# Altium project monitorHolter.PrjPcb (part 1 of 2)
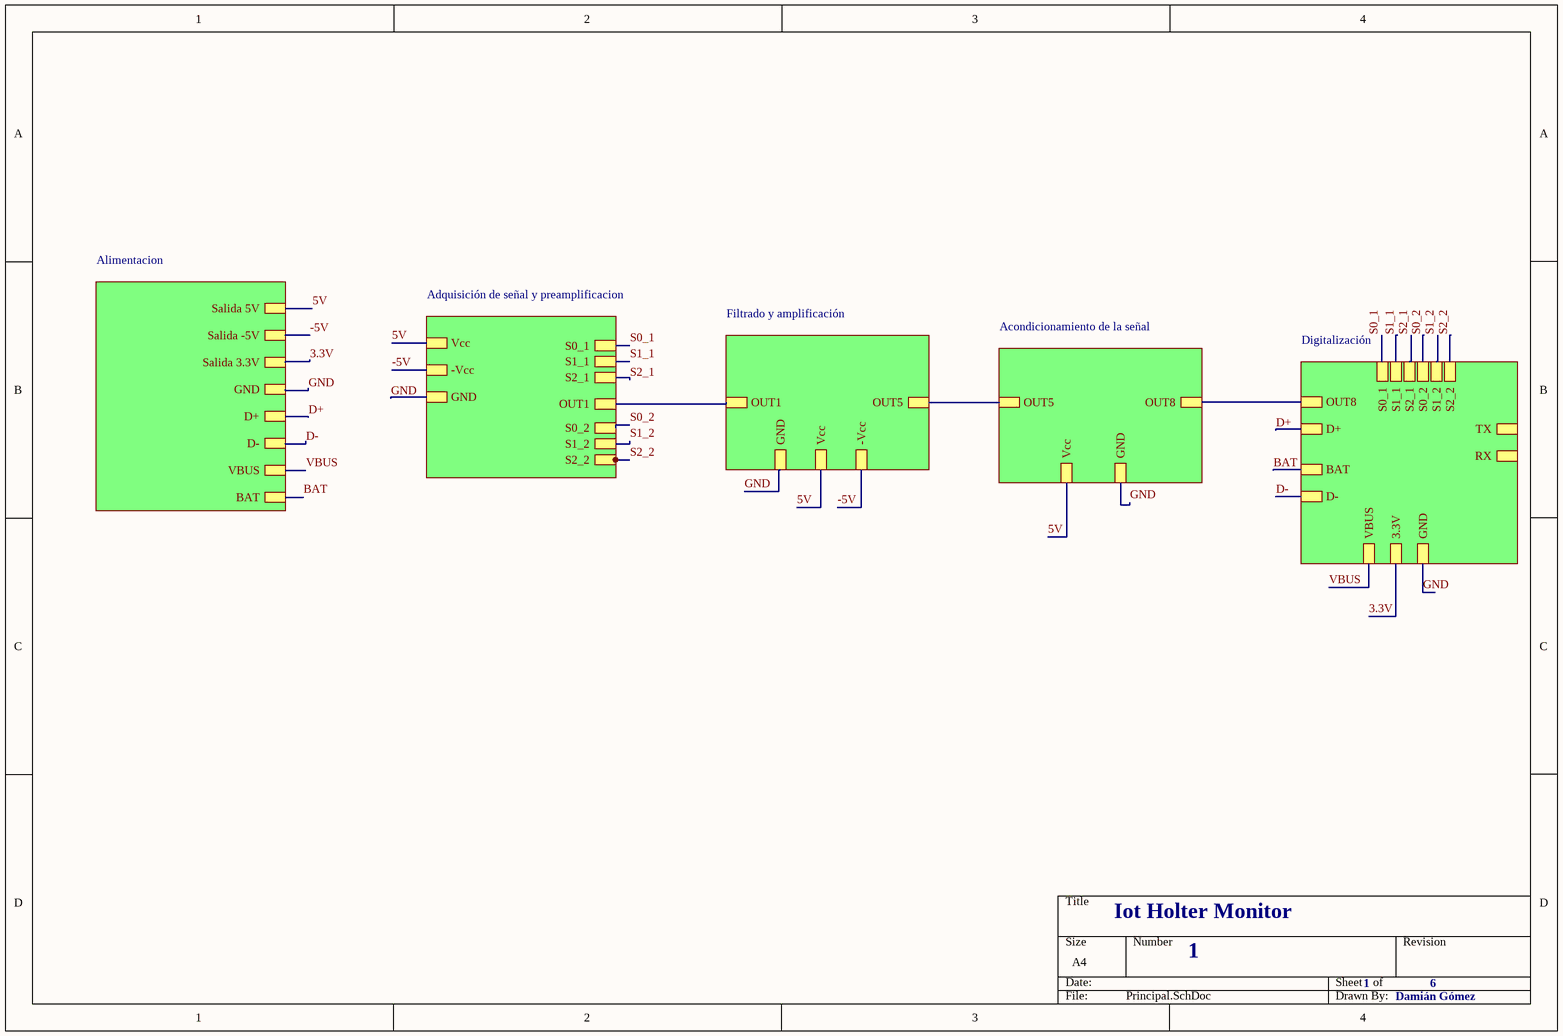
[diagram p0: Principal.SchDoc]
6 sheets, 147 parts. Net scope: hierarchical (ports join the sheet entries above them; power ports are global).
Board files: PCB1.PcbDoc, PCB_MonitorHolter.PcbDoc
Sheets:
  Principal.SchDoc
    Alimentacion = Alimentacion.SchDoc
    Adquisición de señal y preamplificacion = Adquisicion de señal y preamplificacion.SchDoc
    Filtrado y amplificación = Filtrado y amplificación.SchDoc
    Acondicionamiento de la señal = Acondicionamiento de la señal.SchDoc
    Digitalización = Digitalización.SchDoc

## Sheet Principal.SchDoc
size A4; SheetNumber: 1

### Sub-sheets
Acondicionamiento de la señal = Acondicionamiento de la señal: OUT8, OUT5, Vcc, GND
Adquisición de señal y preamplificacion = Adquisicion de señal y preamplificacion: -Vcc, Vcc, GND, S2_1, S1_2, S1_1, S0_2, S0_1, S2_2, OUT1
Alimentacion = Alimentacion: Salida 3.3V, Salida -5V, Salida 5V, GND, D-, D+, VBUS, BAT
Digitalización = Digitalización: VBUS, TX, RX, GND, D-, D+, BAT, 3.3V, OUT8, S0_1, S1_1, S1_2, S0_2, S2_1, S2_2
Filtrado y amplificación = Filtrado y amplificación: OUT5, OUT1, GND, Vcc, -Vcc

### Nets
GND: sheet Alimentacion/GND, sheet Adquisición de señal y preamplificacion/GND, sheet Filtrado y amplificación/GND, sheet Acondicionamiento de la señal/GND, sheet Digitalización/GND
VBUS: sheet Alimentacion/VBUS, sheet Digitalización/VBUS
3.3V: sheet Alimentacion/Salida 3.3V, sheet Digitalización/3.3V
5V: sheet Alimentacion/Salida 5V, sheet Adquisición de señal y preamplificacion/Vcc, sheet Filtrado y amplificación/Vcc, sheet Acondicionamiento de la señal/Vcc
-5V: sheet Alimentacion/Salida -5V, sheet Adquisición de señal y preamplificacion/-Vcc, sheet Filtrado y amplificación/-Vcc
BAT: sheet Alimentacion/BAT, sheet Digitalización/BAT
D+: sheet Alimentacion/D+, sheet Digitalización/D+
D-: sheet Alimentacion/D-, sheet Digitalización/D-
OUT1: sheet Adquisición de señal y preamplificacion/OUT1, sheet Filtrado y amplificación/OUT1
OUT5: sheet Filtrado y amplificación/OUT5, sheet Acondicionamiento de la señal/OUT5
OUT8: sheet Acondicionamiento de la señal/OUT8, sheet Digitalización/OUT8
S0_1: sheet Adquisición de señal y preamplificacion/S0_1, sheet Digitalización/S0_1
S0_2: sheet Adquisición de señal y preamplificacion/S0_2, sheet Digitalización/S0_2
S1_1: sheet Adquisición de señal y preamplificacion/S1_1, sheet Digitalización/S1_1
S1_2: sheet Adquisición de señal y preamplificacion/S1_2, sheet Digitalización/S1_2
S2_1: sheet Adquisición de señal y preamplificacion/S2_1, sheet Digitalización/S2_1
S2_2: sheet Adquisición de señal y preamplificacion/S2_2, sheet Digitalización/S2_2

### Notes on the sheet
- Iot Holter Monitor
- 1
- 6
- Damián Gómez

## Sheet Alimentacion.SchDoc
size A4; SheetNumber: 2
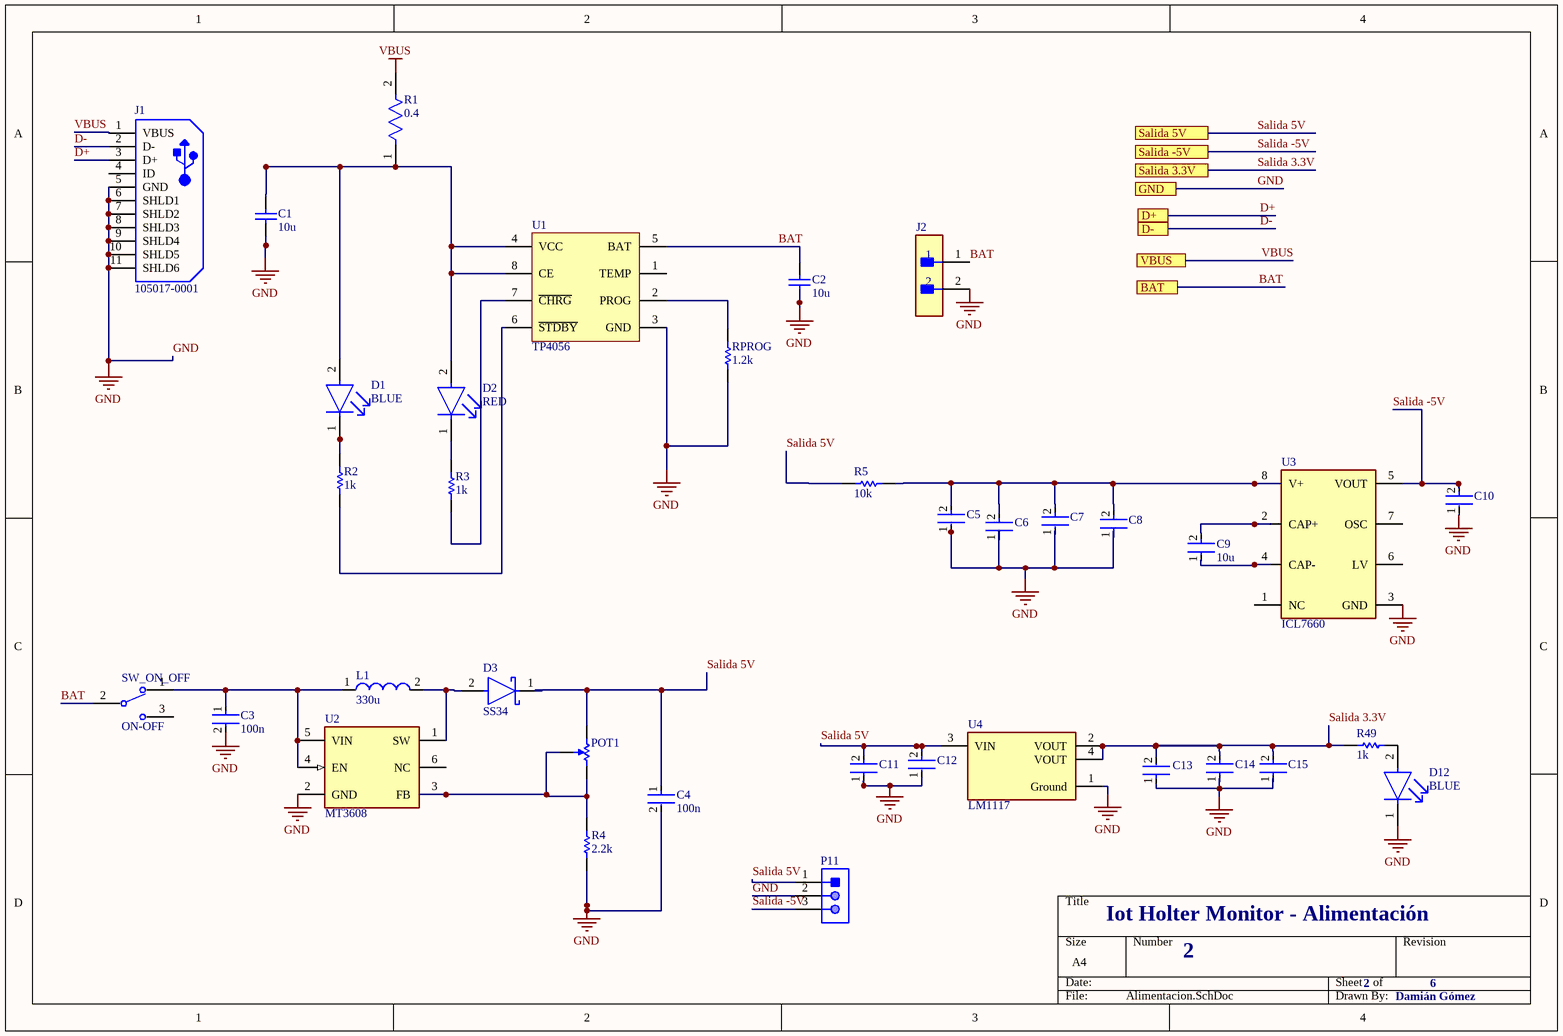
[diagram p1: Alimentacion.SchDoc]

### Parts
C1  10u  [KEMT-1206-2_M]
C2  10u  [CAPC3216X190X55LL30T25]
C3  100n  [FP-CL31-IPC_C]
C4  100n  [FP-CL31-IPC_C]
C5  GRM2165C1H332JA01D  [FP-GRM216-0_1-IPC_B]  (value not drawn)
C6  GRM2165C1H332JA01D  [FP-GRM216-0_1-IPC_B]  (value not drawn)
C7  GRM2165C1H332JA01D  [FP-GRM216-0_1-IPC_B]  (value not drawn)
C8  GRM2165C1H332JA01D  [FP-GRM216-0_1-IPC_B]  (value not drawn)
C9  10u  [FP-GRM216-0_1-IPC_B]
C10  GRM2165C1H332JA01D  [FP-GRM216-0_1-IPC_B]  (value not drawn)
C11  GRM2165C1H332JA01D  [FP-GRM216-0_1-IPC_B]  (value not drawn)
C12  GRM2165C1H332JA01D  [FP-GRM216-0_1-IPC_B]  (value not drawn)
C13  10uF  [FP-CL31-IPC_C]  (value not drawn)
C14  GRM2165C1H332JA01D  [FP-GRM216-0_1-IPC_C]  (value not drawn)
C15  GRM2165C1H332JA01D  [FP-GRM216-0_1-IPC_C]  (value not drawn)
D1  BLUE  [FP-LTST-C191TBKT-MFG]
D2  RED  [FP-LTST-C191TBKT-MFG]
D3  SS34  [FP-95402-MFG]
D12  BLUE  [FP-LTST-C191TBKT-MFG]
J1  105017-0001  [USB-MICRO-B_V]
J2  TSW-102-07-L-S  [FP-TSW-102-07-L-S-MFG]  (value not drawn)
L1  330u  [WE-PD 1050]
P11  640456-3  [TECO-640456-3]  (value not drawn)
POT1  3386P-1-104LF  [BOUR-3386P]  (value not drawn)
R1  0.4  [FP-RC3216-MFG]
R2  1k  [RESC2013X50X30LL20T20]
R3  1k  [RESC2013X50X30LL20T20]
R4  2.2k  [RESC2013X50X30LL20T20]
R5  10k  [RESC2013X50X30LL20T20]
R49  1k  [RESC2013X50X30LL20T20]
RPROG  1.2k  [RESC2013X50X30LL20T20]
SW_ON_OFF  ON-OFF  [FP-1825115-1-MFG]
U1  TP4056  [LT-S8-8_N]
U2  MT3608  [FP-SOT26_SC74R-MFG]
U3  ICL7660  [FP-S8-4-MFG]
U4  LM1117  [FP-AMS1117-IPC_C]

### Ports
BAT, D+, D-, GND, Salida 3.3V, Salida 5V, Salida -5V, VBUS

### Nets
GND: C1.1 C2.1 C3.2 C4.2 C5.1 C6.1 C7.1 C8.1 C10.1 C11.1 C12.1 C13.1 C14.1 C15.1 D12.1(C) J1.5(GND) J1.6(SHLD1) J1.7(SHLD2) J1.8(SHLD3) J1.9(SHLD4) J1.10(SHLD5) J1.11(SHLD6) J2.2 P11.2 R4.1 RPROG.1 U1.3(GND) U2.2(GND) U3.3(GND) U4.1(Ground) ; port GND
VBUS: J1.1(VBUS) R1.2 ; port VBUS
BAT: C2.2 J2.1 SW_ON_OFF.2 U1.5(BAT) ; port BAT
D+: J1.3(D+) ; port D+
D-: J1.2(D-) ; port D-
Salida 3.3V: C13.2 C14.2 C15.2 R49.1 U4.2(VOUT) U4.4(VOUT) ; port Salida 3.3V  [project net 3.3V]
Salida 5V: C4.1 C11.2 C12.2 D3.1(C) P11.1 POT1.1 R5.1 U4.3(VIN) ; port Salida 5V  [project net 5V]
Salida -5V: C10.2 P11.3 U3.5(VOUT) ; port Salida -5V  [project net -5V]
NetC1_2: C1.2 D1.2(A) D2.2(A) R1.1 U1.4(VCC) U1.8(CE)
NetC3_1: C3.1 L1.1 SW_ON_OFF.1 U2.4(EN) U2.5(VIN)
NetC5_2: C5.2 C6.2 C7.2 C8.2 R5.2 U3.8(V+)
NetC9_1: C9.1 U3.4(CAP-)
NetC9_2: C9.2 U3.2(CAP+)
NetD1_1: D1.1(C) R2.2
NetD2_1: D2.1(C) R3.2
NetD3_2: D3.2(A) L1.2 U2.1(SW)
NetD12_2: D12.2(A) R49.2
NetPOT1_2: POT1.2 POT1.3 R4.2 U2.3(FB)
NetR2_1: R2.1 U1.6(~{STDBY})
NetR3_1: R3.1 U1.7(~{CHRG})
NetRPROG_2: RPROG.2 U1.2(PROG)

Not connected (* = marked no-connect by the designer): J1 4(ID); SW_ON_OFF 3; U1 1(TEMP); U2 6(NC); U3 1(NC) 6(LV) 7(OSC)

### Notes on the sheet
- Iot Holter Monitor - Alimentación
- 2
- 6
- Damián Gómez

### Library data of the parts
C1 = CMP-1037-04202-2: CAP, Ceramic, 0.1 uF, +/- 10%, 50 V, -55 to 125 degC, 1206 (3216 Metric), RoHS, Tape and Reel; Manufacturer: Kemet; Voltage Rating: 50V; Capacitance: 0.1µF; Product Range: KEMET-CSeries; SVHC: ToBeAdvised; Dielectric Characteristic: X7R; Capacitor Case Style: 1206[3216Metric]; Package Reference: 1206-2; Package Description: 2-Leads SMD, Body 3.2 x 1.6 mm; Packaging: Tape&Reel; Operating Temperature Max: 125degC; Capacitance Tolerance: ±10%; Datasheet URL: https://datasheet.ciiva.com/6125/1725438-6125494.pdf; Manufacturer URL: http://www.kemet.com/; Operating Temperature Min: -55degC; Datasheet Version: Jul-13
C2 = CMP-1662-00011-2: Chip Capacitor, 10 uF, +/- 20%, 6.3 V, -55 to 85 degC, 1206 (3216 Metric), RoHS, Tape and Reel; PartNumber: GRM31CR60J107ME39L; Case\/Package: 1206; Capacitance: 100 uF; Voltage Rating (DC): 6.3 V; Type (Capacitors): X5R; REACH SVHC: No SVHC; Height: 1.6 mm; Tolerance: 20%; Packaging: Tape and Reel; Mount: Surface Mount; PackageDescription: 2-Pin Surface Mount Device, Body 3.2 x 1.6 mm; ComponentLink1URL: http://www.murata.com/; Pins: 2; ComponentLink2Description: Datasheet; PackageReference: 1206; Width: 1.6 mm; Package Quantity: 2000; Min Operating Temperature: -55 degC; Case Code (Imperial): 1206; Max Operating Temperature: 85 degC; DatasheetVersion: 09/2016; Mounting Technology: Surface Mount; Voltage Rating: 6.3 V; ComponentLink1Description: Manufacturer URL; Radiation Hardening: No; Case Code (Metric): 3216; Length: 3.2 mm; ComponentLink2URL: http://psearch.en.murata.com/capacitor/product/GRM31CR60J107ME39%23.pdf; RoHSCompliant: true
C3 C4 = CMP-13271-001211-1: Cap Ceramic 100nF 500V C0G ±5% SMD 1206 +125°C Embossed T/R; Capacitance: 220pF; Tolerance: 5%; Voltage Rating (DC): 500V; Depth: 1.6mm; Max Operating Temperature: 125°C; Width: 0.063inch; Radiation Hardening: No; Thickness: 0.055inch; Packaging: Tape and Reel; Height: 1.25mm; Case/Package: 1206; Package Quantity: 10000; Dielectric: C0G; Mount: Surface Mount; Voltage Rating: 500V; Min Operating Temperature: -55°C; Length: 3.2mm
C5-C12 C14 C15 = CMP-2007-00889-2: Chip Multilayer Ceramic Capacitors for General Purpose, 0805, 3300pF, C0G, 30ppm/°C, 5%, 50V; Insulation Resistance: 10GR; Capacitance: 3.3nF; Mount: Surface Mount; Case/Package: 0805; Case Code (Imperial): 0805; Lead Free: Lead Free; RoHS Compliant: Yes; Dielectric: C0G; Material: Ceramic; Size: 0.6mm; Voltage Rating (DC): 50V; Voltage: 50V; Termination: SMD/SMT; Case Code (Metric): 2012; Construction: Flat; Max Operating Temperature: 125°C; Series: GRM; Min Operating Temperature: -55°C; Temperature Coefficient: 30ppm/°C; Packaging: Tape and Reel; Height: 0.6mm; REACH SVHC: No SVHC; Width: 0.049inch; Length: 2mm; Thickness: 0.028inch; Voltage Rating: 50V; Tolerance: 5%; Number of Pins: 2; Package Quantity: 1; Dielectric Material: Ceramic; Depth: 1.25mm
C13 = CMP-13271-001211-1: Cap Ceramic 10uF 500V C0G ±5% SMD 1206 +125°C Embossed T/R; Capacitance: 220pF; Tolerance: 5%; Voltage Rating (DC): 500V; Depth: 1.6mm; Max Operating Temperature: 125°C; Width: 0.063inch; Radiation Hardening: No; Thickness: 0.055inch; Packaging: Tape and Reel; Height: 1.25mm; Case/Package: 1206; Package Quantity: 10000; Dielectric: C0G; Mount: Surface Mount; Voltage Rating: 500V; Min Operating Temperature: -55°C; Length: 3.2mm
D1 D2 D12 = CMP-22017-000008-1: LED BLUE CLEAR CHIP SMD; Lens Color: Colorless; Dominant Wavelength: 475nm; Forward Current: 20mA; Wavelength: 468nm; Viewing Angle: 130°; Power Dissipation: 76mW; Luminous Intensity: 180mcd; Reverse Voltage: 5V; Number of Elements: 1; Lens Style: Diffused; Forward Voltage: 3.8V; Max Power Dissipation: 75mW; Case Code (Metric): 1608; Packaging: Tape and Reel; Case/Package: 0603; Depth: 1.6mm; Mount: Surface Mount; Lead Free: Lead Free; Min Operating Temperature: -20°C; Lens Transparency: Clear; Illumination Color: Blue; Height: 0.55mm; Test Current: 20mA; Case Code (Imperial): 0603; Max Operating Temperature: 80°C; Number of Pins: 2; Length: 0.8mm; Radiation Hardening: No; Package Quantity: 1; Number of LEDs: 1; Width: 0.8mm; Color: Blue
D3 = CMP-02539-000012-1: DIODE SCHOTTKY 40V 3A DO214AB; Manufacturer: Vishay; Manufacturer Part Number: SS34-E3/57T; Max Junction Temp: +150°C; Peak Reverse Current: 0.5mA; Max Surge Forward Current: 100A; Standoff Height: 0mm; ComponentLink2Description: Datasheet; Device Class L3: Schottky Diodes; Height: 2.62mm; Max Repetitive Reverse Voltage: 40V; Lead Free: Yes; Package: 95402; Temperature Range High: +150°C; ComponentLink2URL: http://www.vishay.com/docs/88751/ss32.pdf; Temperature: -55°C to +150°C; Footprint Url: http://www.vishay.com/docs/95402/smc.pdf; Automotive: No; Forward Current: 3A; Category: Diode; RoHS: TRUE; Device Class L2: Diodes; Mouser Description: Schottky Diodes & Rectifiers 3.0 Amp 40 Volt; Octopart: https://octopart.com/ss34-e3%2F57t-vishay-39552907; Temperature Range Low: -55°C; Device Class L1: Discrete Semiconductors; Digikey Description: DIODE SCHOTTKY 40V 3A DO214AB
J1 = CMP-2000-05827-1: Micro-USB B Receptacle, Right Angle, Bottom Mount, Surface Mount, with Solder Tabs, -30 to 85 degC, 5-Pin USB, RoHS, Tape and Reel; Manufacturer: Molex; Featured Product: Micro-USBConnectorsUSBConnectors; Other Names: WM1399DKR; Package Version: Rev. F, 12/2012; Number of Contacts: 5; Connector Type: USB-microB; Catalog Drawings: 1050170001; 3D Model: 105017-0001.stp; Mating Products: WM17145-ND-CABLEMICROUSBBTOSTDA1.0MWM17147-ND-CABLEMICROUSBBTOSTDA2.0MWM17146-ND-CABLEMICROUSBBTOSTDA1.5M; PCN Assembly/Origin: ResinSupplier21/Oct/2015; Voltage - Max: 30V; Online Catalog: Molex-MicroUSB; Manufacturer URL: http://www.molex.com/; Package Description: 5-Leads USB, Micro B, Body 7.5 x 5 mm, Pitch 0.65 mm; Datasheet URL: http://www.molex.com/elqNow/elqRedir.htm?ref=http://www.molex.com/webdocs/datasheets/pdf/en-us/1050170001_IO_CONNECTORS.pdf; Ingress Protection: -; Datasheet Version: 03/2016; Mounting Type: BoardCutout,SurfaceMount,RightAngle; Circuits: 5; Standard Package: 1; Package Reference: MICRO-B; Package URL: http://www.molex.com/pdm_docs/sd/1050170001_sd.pdf; Category: Connectors,Interconnects; Series: -; RoHS Information: 1050170001CertofCompliance; Features: Shielded,SolderRetention; Family: USB,DVI,HDMIConnectors; Specifications: -; Gender: Receptacle; Packaging: Digi-Reel®; Mounting Technology: SurfaceMount
J2 = CMP-02766-001428-1: CONN HEADER VERT 2POS 2.54MM; Voltage Rating: 550V; Current Rating: 7.6A; Gender: Male; Number of Contacts: 2; Connector Type: Male Pin; Radiation Hardening: No; Orientation: Straight; Contact Plating: Gold; Max Operating Temperature: 125°C; Mount: Through Hole; Package Quantity: 1; Number of Rows: 1; Housing Material: Polyester; RoHS Compliant: Yes; Length: 5.08mm; Max Voltage Rating (AC): 550V; Pitch: 2.54mm; Packaging: Bulk; Depth: 2.54mm; Termination: Solder; Min Operating Temperature: -55°C; Housing Color: Black; Lead Free: Lead Free; Color: Black; Number of Positions: 2; Width: 2.54mm; Max Current Rating: 7.6A; REACH SVHC: No SVHC; Contact Material: Bronze; Contact Mating Length: 0.23inch; Series: TSW; Contact Type: Male Pin
L1 = CMP-1396-00019-1: SMD-Shielded Power Inductor WE-PD, L=330 µH; Manufacturer: Wuerth Elektronik; PartNumber: 7447714331; Inductance: 330 ÂµH; PackageReference: WE-PD 1050; ComponentLink1URL: http://www.we-online.com; ComponentLink1Description: Manufacturer URL; ComponentLink2Description: Datasheet; ComponentLink2URL: http://www.we-online.de/katalog/media/pdf/7447714331.pdf
P11 = CMP-2000-05418-1: Male Header, Pitch 2.54 mm, 1 x 3 Position, Height 10.03 mm, Tail Length 3.56 mm, -55 to 105 degC; Manufacturer: TE Connectivity; Agency Approvals: CSA,UL; Angle: Straight; Number of Positions: 3; Standards: RoHSCompliant,ELVCompliant,UL94V-0; Current, Rating: 5 / A; Connector Type: MTA-100; Mount Angle: Vertical; Material, Housing: Polyester; Temperature, Operating: -55to+105 / degC; Voltage, Rating: 250 / V; Color, Housing: White; Contact Centerline Spacing: 0.100 / in.; Special Features: Pinstrip; Material, Contact: CopperAlloy; Contact Termination Area Plating: Tin; Primary Type: InterconnectSystem; Pin Spacing: 0.1 / "; Brand/Series: MTA-100Series; Mounting Hole Size: 0.04 / "; Manufacturer URL: http://www.te.com/; Datasheet URL: https://datasheet.ciiva.com/16456/eng-ds-82056-mta-0608-16456886.pdf; Flammability Rating: UL94V-0; Mounting Type: PCMount; Contact Mating Area Plating: Tin; Datasheet Version: Jun-08; Number of Rows: 1; Termination: Solder; Type: PCBPlug; Length, Pin: 0.14 / "; Color: White; Contact Plating: Tin; Contact Shape: Square; Number of Contacts: 3; Size, Post: 0.025 / in.; Length, Terminal Post: 0.14 / in.; Length, Overall: 0.3 / "
POT1 = CMP-2000-05592-1: Square Trimpot(R) Trimming Potentiometer, 100 KOhm, +/- 10%, 0.5 W, -55 to 125 degC, 3-Pin THD, RoHS, Tube; Manufacturer Series: 3386; Manufacturer: Bourns; Resistive Element Material: Cermet; Shaft Diameter: 3.15mm; Number of Turns: 1; Product Height: 4.83mm; Temperature Coefficient: 100ppm/C; Product Depth: 9.53mm; Rated Temperature (Cel): 85; Actuator Orientation: Vertical; Resistance (ohm): 100000; Power Rating: 1/2W; Tolerance (%): 10; Rated Power Dissipation (P) (W): 0.5; Resistance Law: Linear; Actuator Type: Screw; Operating Temperature-Min (Cel): -55; Manufacturer URL: http://www.bourns.com/; Terminal Finish: TINLEAD; Datasheet Version: 05/2016; Tolerance: 10%; Lead Free: NO; Family: 3386; Product Length: 9.53mm; Mounting: ThroughHole; Packaging: Tube; Package: RectangularPackage; Mounting Feature: ThroughHole; Number of Terminals: 3; Minimum Operating Temperature: -55C; Mounting Technology: ThroughHole; Package Reference: 3386P; Maximum Operating Temperature: 125C; Termination Style: Pin; Datasheet URL: http://www.bourns.com/docs/Product-Datasheets/3386.pdf; Package Description: 3-Pin Through Hole Device, Body 9.53 x 9.53 mm, Pitch 2.54 mm; Product Type: Potentiometer; Operating Temperature-Max (Cel): 125; Resistance Value: 100KOhm; Terminal Shape: WIRE; Technology: Cermet; Type: Trimmer
R1 = CMP-13261-001932-1: Res Thick Film 1206 1kΩ 5% 0.25W ±100ppm/°C Molded SMD T/R; Max Power Dissipation: 250mW; Resistance: 1kR; Voltage Rating (DC): 200V; Width: 0.063inch; Length: 0.126inch; Min Operating Temperature: -55°C; Packaging: Tape and Reel; Case Code (Metric): 3216; Contact Plating: Tin; Composition: Thick Film; Military Standard: Not; Depth: 1.6mm; Lead Free: Lead Free; Height: 0.026inch; Case Code (Imperial): 1206; Number of Terminations: 2; Radiation Hardening: No; Case/Package: 1206; Features: Moisture Resistant; Power Rating: 250mW; Max Operating Temperature: 155°C; Tolerance: 5%; Temperature Coefficient: 100ppm/°C
R2-R5 R49 RPROG = CMP-2001-04896-1: Manufacturer: Vishay Dale; Part Number: CRCW08050000Z0EA
SW_ON_OFF = CMP-03405-000003-1: SWITCH SLIDE SPDT 250MA 125V; Manufacturer Part Number: 1825115-1; Manufacturer: TE Connectivity; Operating Force: 250gf; Electromechanical Life: 6000Cycles; Contact Resistance: 30mΩ; Voltage Rating Dc: 12V; Temperature Range High: +85°C; Temperature: -10°C to +85°C; Package: 1825115-1; Voltage Rating Ac: 125V; Category: Switch; Digikey Description: SWITCH SLIDE SPDT 250MA 125V; Throw Configuration: SPDT; RoHS: TRUE; Mount: Through Hole; Device Class L2: Switches; ComponentLink2Description: Datasheet; Automotive: No; ComponentLink2URL: https://www.te.com/usa-en/product-1825115-1.html?te_bu=Cor&te_type=other&te_campaign=oct_glo_cor-oct-global-oth-prtnr-fy19-oct-octo-buy-bom_sma-298_2&elqCampaignId=35216; Contact Current Rating: 250mA; Temperature Range Low: -10°C; Device Class L3: Slide Switches; Device Class L1: Electromechanical; Octopart: https://octopart.com/sls121pc04-te+connectivity-39426454; Lead Free: Yes
U1 = CMP-0471-00511-1: Standalone Li-Ion Switch Mode Battery Charger, 4.7 to 22 V Vin, 8-pin SOIC (S8-8), -40 to 85 degC, Pb-Free; Manufacturer: Linear Technology; PartNumber: LTC4002ES8-4.2#PBF; Battery Chemistry: Li-Ion, Li-Polymer; Number of Cells: 1; Float Voltage: 4.2 V; Type of Charger: Switching; Charge Termination: On-board timer; Vin Min(V): 4.7; Vin Max(V): 22; ComponentLink3Description: Package Specification; ComponentLink2URL: http://cds.linear.com/docs/en/datasheet/4002f.pdf; Mounting Technology: Surface Mount; ComponentLink3URL: http://cds.linear.com/docs/en/packaging/05081610_G_SO8.pdf; PackageVersion: Rev. G, 03/2012; RoHS: TRUE; PackageReference: S8-8; PackageDescription: 8-Pin Plastic Small Outline (Narrow .150 Inch), Body 4.9 x 3.9 mm, Pitch 1.27 mm; ComponentLink1URL: http://www.linear.com/; ComponentLink2Description: Datasheet; ComponentLink1Description: Manufacturer URL
U2 = CMP-12753-000004-1: IC LED DRIVER RGLTR DIM SOT23-6; Manufacturer Part Number: AP3032KTR-G1; Manufacturer: Diodes Inc.; Max Junction Temp: +150°C; Switching Frequency: 1MHz; Output Voltage: 27V; Min Supply Voltage: 2.7V; Switching Topology: Boost; Number Of Outputs: 1; Max Supply Voltage: 9V; Standoff Height: 0.013mm; Nominal Supply Current: 4mA; Dimming: PWM; Temperature Range High: +85°C; Temperature: -40°C to +85°C; ComponentLink2URL: https://www.diodes.com/assets/Datasheets/AP3032.pdf; Category: IC; Digikey Description: IC LED DRIVER RGLTR DIM SOT23-6; Device Class L1: Integrated Circuits (ICs); Footprint Url: https://www.diodes.com/assets/Package-Files/SOT26-SC74R.pdf; RoHS: TRUE; Device Class L3: LED Drivers; Octopart: https://octopart.com/ap3032ktr-g1-diodes+inc.-30954666; Mouser Description: Voltage Regulators - Switching Regulators White LED Step-Up 1.4A 6.8uH 200mV; Ipc Land Pattern Name: SOT95P280X115-6; Lead Free: Yes; Device Class L2: Power Management ICs; Height: 1.4mm; ComponentLink2Description: Datasheet; Temperature Range Low: -40°C; Package: SOT26 (SC74R); Automotive: No
U3 = CMP-05722-000015-1: IC REG CHARG PUMP INV 20MA 8SOIC; Manufacturer Part Number: ICL7660ESA+; Manufacturer: Maxim Integrated; Standoff Height: 0.1mm; Switching Frequency: 10kHz; Max Supply Voltage: 10V; Min Supply Voltage: 1.5V; Output Voltage: -10/+20V; Output Type: Fixed; Number Of Outputs: 1; Max Power Dissipation: 471mW; Nominal Supply Current: 80uA; Switching Topology: Charge Pump; Negative Voltage Available: true; Automotive: No; Height: 1.75mm; Temperature: -40°C to +85°C; Digikey Description: IC REG CHARG PUMP INV 20MA 8SOIC; ComponentLink2Description: Datasheet; Category: IC; Lead Free: Yes; Output Current: 20mA; Temperature Range High: +85°C; Mouser Description: Switching Voltage Regulators Switched-Capacitor Voltage Converter; ComponentLink2URL: https://datasheets.maximintegrated.com/en/ds/ICL7660-MAX1044.pdf; Device Class L1: Integrated Circuits (ICs); Footprint Url: https://pdfserv.maximintegrated.com/land_patterns/90-0096.PDF; Temperature Range Low: -40°C; Device Class L2: Power Management ICs; RoHS: TRUE; Octopart: https://octopart.com/icl7660esa%2B-maxim+integrated-39427429; Package: S8-4; Device Class L3: Voltage Regulators - Switching
U4 = CMP-209535-000001-1: LDO Voltage Regulators 1A, 3.3V; Manufacturer Part Number: AMS1117-3.3; Manufacturer: Advanced Monolithic Systems; Dropout Voltage: 1.1V; Output Type: Fixed; Nominal Supply Current: 5mA; Max Power Dissipation: 1.2W; Max Supply Voltage: 15V; Number Of Outputs: 1; Standoff Height: 0.64mm; Max Junction Temp: +125°C; Height: 1.8mm; Package: AMS1117; Device Class L2: Power Management ICs; ComponentLink2Description: Datasheet; ComponentLink2URL: http://www.advanced-monolithic.com/pdf/ds1117.pdf; Category: IC; RoHS: TRUE; Automotive: No; Device Class L1: Integrated Circuits (ICs); Output Current: 1A; Device Class L3: Voltage Regulators - Linear; Temperature: -40°C to +125°C; Output Voltage: 3.3V; Temperature Range Low: -40°C; Octopart: https://octopart.com/ams1117-3.3-advanced+monolithic+systems-25899300; Lead Free: Yes; Ipc Land Pattern Name: SOT229P700X180-4; Temperature Range High: +125°C

## Sheet Adquisicion de señal y preamplificacion.SchDoc
size 400 x 400 mm; SheetNumber: 3
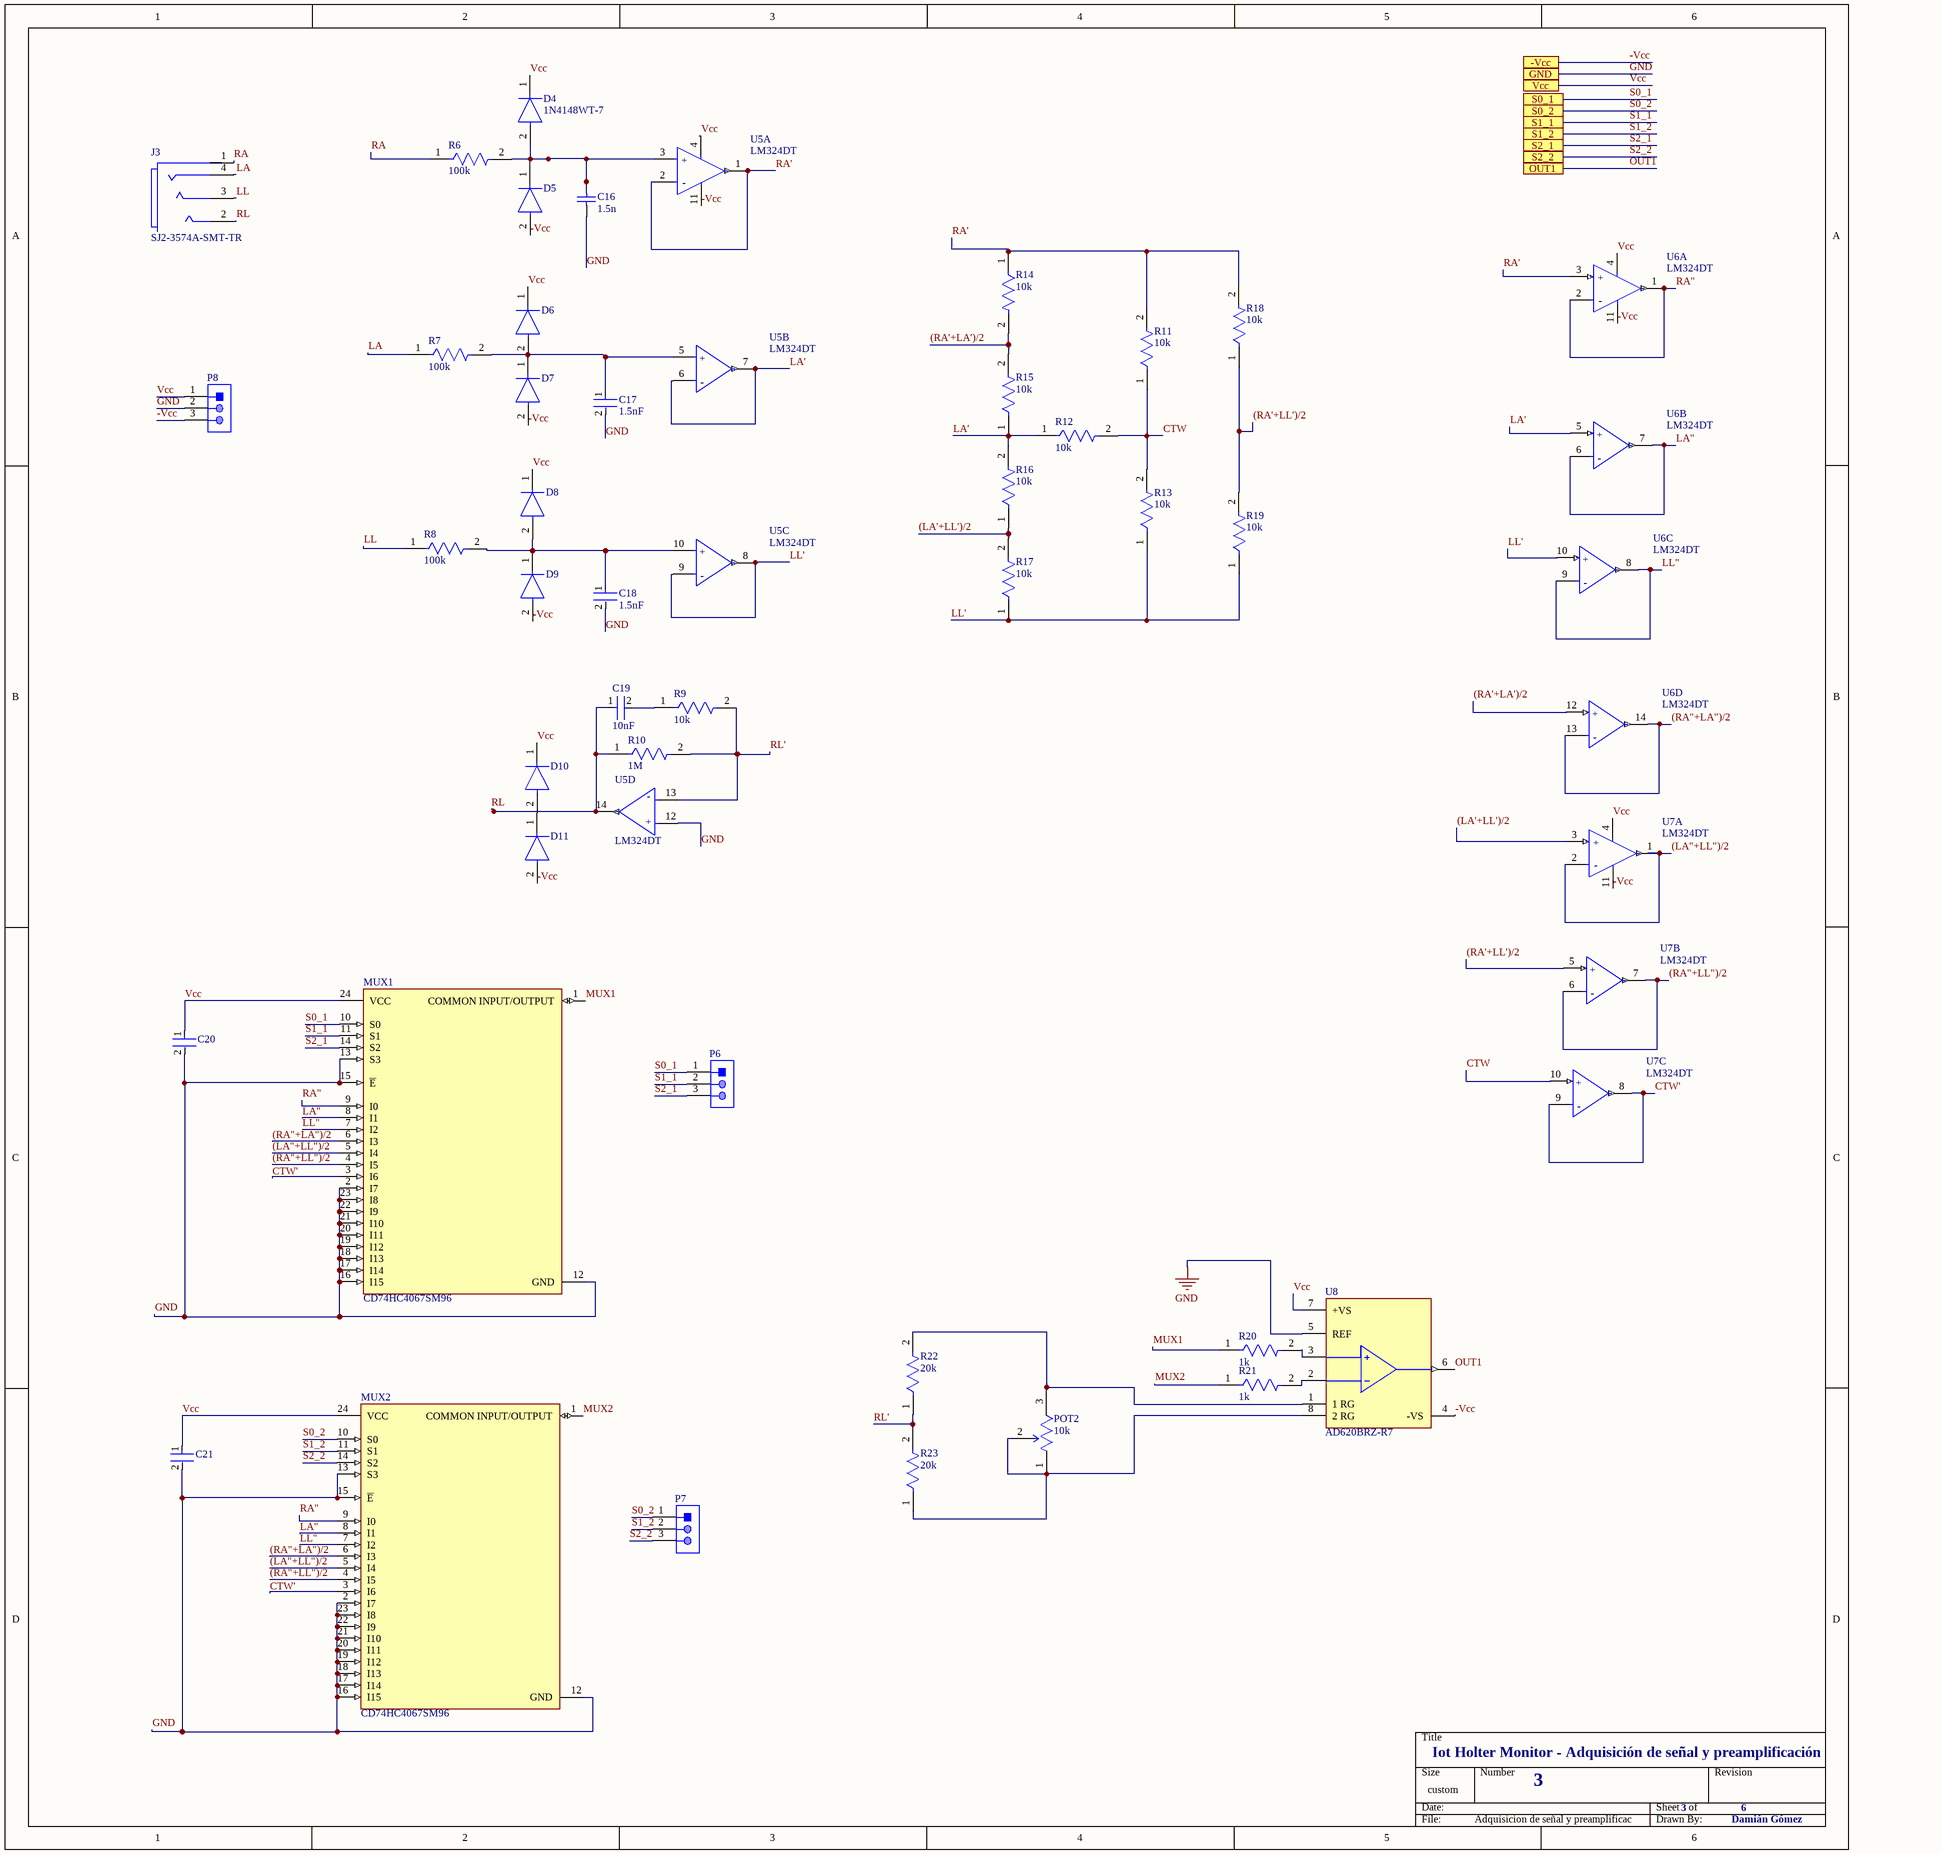
[diagram p2: Adquisicion de señal y preamplificacion.SchDoc]

### Parts
C16  1.5n  [KEMT-1206-2_M]
C17  1.5nF  [FP-CL31-IPC_C]
C18  1.5nF  [FP-CL31-IPC_C]
C19  10nF  [FP-CL31-IPC_C]
C20  (no value)  [FP-0603-L_1_6_0_15-W_0_81-IPC_A]
C21  (no value)  [FP-0603-L_1_6_0_15-W_0_81-IPC_A]
D4  1N4148WT-7  [FP-SOD523-MFG]
D5  1N4148WT-7  [FP-SOD523-MFG]  (value not drawn)
D6  1N4148WT-7  [FP-SOD523-MFG]  (value not drawn)
D7  1N4148WT-7  [FP-SOD523-MFG]  (value not drawn)
D8  1N4148WT-7  [FP-SOD523-MFG]  (value not drawn)
D9  1N4148WT-7  [FP-SOD523-MFG]  (value not drawn)
D10  1N4148WT-7  [FP-SOD523-MFG]  (value not drawn)
D11  1N4148WT-7  [FP-SOD523-MFG]  (value not drawn)
J3  SJ2-3574A-SMT-TR  [FP-SJ2-3574A-SMT-TR-MFG]
MUX1  CD74HC4067SM96  [FP-DB0024A-IPC_C]
MUX2  CD74HC4067SM96  [FP-DB0024A-IPC_C]
P6  640456-3  [TECO-640456-3]  (value not drawn)
P7  640456-3  [TECO-640456-3]  (value not drawn)
P8  640456-3  [TECO-640456-3]  (value not drawn)
POT2  10k  [FP-3296W-MFG]
R6  100k  [FP-RC3216-MFG]
R7  100k  [FP-RC3216-MFG]
R8  100k  [FP-RC3216-MFG]
R9  10k  [FP-RC3216-MFG]
R10  1M  [FP-RC3216-MFG]
R11  10k  [FP-RC3216-MFG]
R12  10k  [FP-RC3216-MFG]
R13  10k  [FP-RC3216-MFG]
R14  10k  [FP-RC3216-MFG]
R15  10k  [FP-RC3216-MFG]
R16  10k  [FP-RC3216-MFG]
R17  10k  [FP-RC3216-MFG]
R18  10k  [FP-RC3216-MFG]
R19  10k  [FP-RC3216-MFG]
R20  1k  [FP-RC3216-MFG]
R21  1k  [FP-RC3216-MFG]
R22  20k  [FP-RC3216-MFG]
R23  20k  [FP-RC3216-MFG]
U5  LM324DT  [FP-SO-14-MFG]  (parts A,B,C,D of 4)
U6  LM324DT  [FP-SO-14-MFG]  (parts A,B,C,D of 4)
U7  LM324DT  [FP-SO-14-MFG]  (parts A,B,C of 4)
U8  AD620BRZ-R7  [FP-R-8-IPC_C]

### Ports
-Vcc, GND, OUT1, S0_1, S0_2, S1_1, S1_2, S2_1, S2_2, Vcc

### Nets
GND: C16.1 C17.2 C18.2 C20.2 C21.2 MUX1.2(I7) MUX1.12(GND) MUX1.13(S3) MUX1.15(~{E}) MUX1.16(I15) MUX1.17(I14) MUX1.18(I13) MUX1.19(I12) MUX1.20(I11) MUX1.21(I10) MUX1.22(I9) MUX1.23(I8) MUX2.2(I7) MUX2.12(GND) MUX2.13(S3) MUX2.15(~{E}) MUX2.16(I15) MUX2.17(I14) MUX2.18(I13) MUX2.19(I12) MUX2.20(I11) MUX2.21(I10) MUX2.22(I9) MUX2.23(I8) P8.2 U5.12(Non-Inverting_Input_4) U8.5(REF) ; port GND
(LA"+LL")/2: MUX1.5(I4) MUX2.5(I4) U7.1(Output_1) U7.2(Inverting_Input_1)
(LA'+LL')/2: R16.1 R17.2 U7.3(Non-Inverting_Input_1)
(RA"+LA")/2: MUX1.6(I3) MUX2.6(I3) U6.13(Inverting_Input_4) U6.14(Output_4)
(RA"+LL")/2: MUX1.4(I5) MUX2.4(I5) U7.6(Inverting_Input_2) U7.7(Output_2)
(RA'+LA')/2: R14.2 R15.2 U6.12(Non-Inverting_Input_4)
(RA'+LL')/2: R18.1 R19.2 U7.5(Non-Inverting_Input_2)
-Vcc: D5.2(A) D7.2(A) D9.2(A) D11.2(A) P8.3 U5.11(VCC-) U6.11(VCC-) U7.11(VCC-) U8.4(-VS) ; port -Vcc  [project net -5V]
CTW: R11.1 R12.2 R13.2 U7.10(Non-Inverting_Input_3)
CTW': MUX1.3(I6) MUX2.3(I6) U7.8(Output_3) U7.9(Inverting_Input_3)
LA: J3.4(ring_2) R7.1
LA": MUX1.8(I1) MUX2.8(I1) U6.6(Inverting_Input_2) U6.7(Output_2)
LA': R12.1 R15.1 R16.2 U5.6(Inverting_Input_2) U5.7(Output_2) U6.5(Non-Inverting_Input_2)
LL: J3.3(ring_1) R8.1
LL": MUX1.7(I2) MUX2.7(I2) U6.8(Output_3) U6.9(Inverting_Input_3)
LL': R13.1 R17.1 R19.1 U5.8(Output_3) U5.9(Inverting_Input_3) U6.10(Non-Inverting_Input_3)
MUX1: MUX1.1(COMMON_INPUT/OUTPUT) R20.1
MUX2: MUX2.1(COMMON_INPUT/OUTPUT) R21.1
OUT1: U8.6(OUTPUT) ; port OUT1
RA: J3.1(sleeve) R6.1
RA": MUX1.9(I0) MUX2.9(I0) U6.1(Output_1) U6.2(Inverting_Input_1)
RA': R11.2 R14.1 R18.2 U5.1(Output_1) U5.2(Inverting_Input_1) U6.3(Non-Inverting_Input_1)
RL: C19.1 J3.2(tip) R10.1 U5.14(Output_4)
RL': R9.2 R10.2 R22.1 R23.2 U5.13(Inverting_Input_4)
S0_1: MUX1.10(S0) P6.1 ; port S0_1
S0_2: MUX2.10(S0) P7.1 ; port S0_2
S1_1: MUX1.11(S1) P6.2 ; port S1_1
S1_2: MUX2.11(S1) P7.2 ; port S1_2
S2_1: MUX1.14(S2) P6.3 ; port S2_1
S2_2: MUX2.14(S2) P7.3 ; port S2_2
Vcc: C20.1 C21.1 D4.1(C) D6.1(C) D8.1(C) D10.1(C) MUX1.24(VCC) MUX2.24(VCC) P8.1 U5.4(VCC+) U6.4(VCC+) U7.4(VCC+) U8.7(+VS) ; port Vcc  [project net 5V]
NetC16_2: C16.2 D4.2(A) D5.1(C) R6.2 U5.3(Non-Inverting_Input_1)
NetC17_1: C17.1 D6.2(A) D7.1(C) R7.2 U5.5(Non-Inverting_Input_2)
NetC18_1: C18.1 D8.2(A) D9.1(C) R8.2 U5.10(Non-Inverting_Input_3)
NetC19_2: C19.2 R9.1
NetD10_2: D10.2(A) D11.1(C)
NetPOT2_1: POT2.1(CCW) POT2.2(WIPER) R23.1 U8.8(2_RG)
NetPOT2_3: POT2.3(CW) R22.2 U8.1(1_RG)
NetR20_2: R20.2 U8.3(+IN)
NetR21_2: R21.2 U8.2(-IN)

### Notes on the sheet
- Iot Holter Monitor - Adquisición de señal y preamplificación
- 3
- 6
- Damián Gómez
- (in symbol CMP-12131-000005-1, part A) +; -
- (in symbol CMP-12131-000005-1, part B) +; -
- (in symbol CMP-12131-000005-1, part C) +; -
- (in symbol CMP-12131-000005-1, part D) -; +

### Library data of the parts
C16 = CMP-1037-04202-2: as C1 on sheet Alimentacion; Package Reference: 1206-2; Package Description: 2-Leads SMD, Body 3.2 x 1.6 mm; Packaging: Tape&Reel; Operating Temperature Max: 125degC; Capacitance Tolerance: ±10%; Datasheet URL: https://datasheet.ciiva.com/6125/1725438-6125494.pdf; Manufacturer URL: http://www.kemet.com/; Operating Temperature Min: -55degC; Datasheet Version: Jul-13
C17 C18 = CMP-13271-001211-1: Cap Ceramic 1.5nF 500V C0G ±5% SMD 1206 +125°C Embossed T/R; Capacitance: 220pF; Tolerance: 5%; Voltage Rating (DC): 500V; Depth: 1.6mm; Max Operating Temperature: 125°C; Width: 0.063inch; Radiation Hardening: No; Thickness: 0.055inch; Packaging: Tape and Reel; Height: 1.25mm; Case/Package: 1206; Package Quantity: 10000; Dielectric: C0G; Mount: Surface Mount; Voltage Rating: 500V; Min Operating Temperature: -55°C; Length: 3.2mm
C19 = CMP-13271-001211-1: Cap Ceramic 10nF 500V C0G ±5% SMD 1206 +125°C Embossed T/R; Capacitance: 220pF; Tolerance: 5%; Voltage Rating (DC): 500V; Depth: 1.6mm; Max Operating Temperature: 125°C; Width: 0.063inch; Radiation Hardening: No; Thickness: 0.055inch; Packaging: Tape and Reel; Height: 1.25mm; Case/Package: 1206; Package Quantity: 10000; Dielectric: C0G; Mount: Surface Mount; Voltage Rating: 500V; Min Operating Temperature: -55°C; Length: 3.2mm
C20 C21 = CMP-2006-04378-2: General Purpose Ceramic Capacitor, 0603, 1nF, 10%, X7R, 15%, 50V; Case Code (Metric): 1608; Min Operating Temperature: -55°C; Weight: 7.1E-05oz; Series: -; Capacitance: 1nF; RoHS Compliant: Yes; Radiation Hardening: No; Height: 0.9mm; Mount: Surface Mount; REACH SVHC: No SVHC; Lead Free: Lead Free; Depth: 0.81mm; Voltage: 50V; Number of Pins: 2; Voltage Rating: 50V; Max Operating Temperature: 125°C; Termination: SMD/SMT; Construction: Flat; Case Code (Imperial): 0603; Dielectric: X7R; Width: 0.032inch; Tolerance: 10%; Case/Package: 0603; Contact Plating: Tin; Packaging: Tape and Reel; Voltage Rating (DC): 50V; Dielectric Material: Ceramic; Package Quantity: 4000; Thickness: 0.035inch; Length: 1.6mm
D4-D11 = CMP-2000-05518-3: DIODE GEN PURP 80V 125MA SOD523; Power Rating: 150mW; Peak Non-Repetitive Surge Current: 2A; Forward Voltage: 1.25V; Reverse Recovery Time: 4ns; Peak Reverse Current: 1uA; Max Repetitive Reverse Voltage (Vrrm): 100V; Capacitance: 2pF; Polarity: Standard; Element Configuration: Single; Forward Current: 250mA; Lead Free: Lead Free; Packaging: Tape and Reel; Length: 0.9mm; Min Operating Temperature: -65°C; Current Rating: 125mA; Max Reverse Voltage (DC): 80V; Width: 1.3mm; Package Quantity: 3000; Output Current: 125mA; Power Dissipation: 150mW; Max Operating Temperature: 150°C; Radiation Hardening: No; Average Rectified Current: 125mA; Height: 0.65mm; Voltage Rating (DC): 80V; Max Surge Current: 2A; Weight: 3.5E-05oz; Recovery Time: 4ns; Max Forward Surge Current (Ifsm): 2A; Contact Plating: Tin; Number of Pins: 2; Mount: Surface Mount; REACH SVHC: No SVHC
J3 = CMP-14818-000001-1: AUDIO JACK, 3.5 MM, RT, 4 CONDUC; Manufacturer: CUI; Conn Orientation: Horizontal; Current Rating: 1A; Number Of Contacts: 4; Voltage Rating: 12V; Package: SJ2-3574A-SMT-TR; Device Class L1: Connectors; Lead Free: Yes; Digikey Description: AUDIO JACK, 3.5 MM, RT, 4 CONDUC; Device Class L2: Audio / Video Connectors; ComponentLink2URL: https://www.cui.com/product/resource/sj2-357x-smt.pdf; Automotive: No; RoHS: TRUE; Height: 5.3mm; Temperature Range Low: -25°C; Category: Conn; Temperature: -25°C to +85°C; Octopart: https://octopart.com/sj2-3574a-smt-tr-cui-77838840; Device Class L3: unset; Contact Material: Silver; Manufacturer Part Number: SJ2-3574A-SMT-TR; Temperature Range High: +85°C; ComponentLink2Description: Datasheet
MUX1 MUX2 = CMP-04892-000038-1: IC MUX/DEMUX 1X16 24SSOP; Supply Type: Single; High Level Output Current: 25mA; Min Supply Voltage: 2V; Number of Circuits: 16; Max Supply Voltage: 6V; Number of Channels: 1; Turn-On Delay Time: 300ns; Max Supply Current: 8uA; Bandwidth: 89MHz; Turn-Off Delay Time: 290ns; Propagation Delay: 75ns; Logic Function: Multiplexer; On-State Resistance: 160R; Polarity: Non-Inverting; Width: 5.3mm; Case/Package: SSOP; Max Operating Temperature: 125°C; Mount: Surface Mount; Min Operating Temperature: -55°C; REACH SVHC: No SVHC; Contact Plating: Gold; Max Output Current: 25mA; Weight: 0.006081oz; Height: 1.95mm; Package Quantity: 2000; Length: 8.2mm; Lead Free: Lead Free; Operating Supply Current: 8uA; Packaging: Tape and Reel; Series: 74HC; Low Level Output Current: 25mA; Number of Outputs: 1; Termination: SMD/SMT; Number of Inputs: 16; Number of Bits: 16; Radiation Hardening: No; Number of Pins: 24
P6-P8 = CMP-2000-05418-1: as P11 on sheet Alimentacion; Manufacturer URL: http://www.te.com/; Datasheet URL: https://datasheet.ciiva.com/16456/eng-ds-82056-mta-0608-16456886.pdf; Flammability Rating: UL94V-0; Mounting Type: PCMount; Contact Mating Area Plating: Tin; Datasheet Version: Jun-08; Number of Rows: 1; Termination: Solder; Type: PCBPlug; Length, Pin: 0.14 / "; Color: White; Contact Plating: Tin; Contact Shape: Square; Number of Contacts: 3; Size, Post: 0.025 / in.; Length, Terminal Post: 0.14 / in.; Length, Overall: 0.3 / "
POT2 = CMP-07234-000024-1: TRIMMER 10K OHM 0.5W PC PIN TOP; Resistance: 10kR; Temperature Coefficient: 100ppm/°C; Power Rating: 500mW; Tolerance: 10%; Number of Turns: 25; Width: 0.19inch; Termination: Pin; Radiation Hardening: No; Contact Plating: Tin; Composition: Cermet; Length: 9.53mm; Height: 0.395inch; Depth: 4.83mm; REACH SVHC: No SVHC; Weight: 0.03oz; Min Operating Temperature: -55°C; Military Standard: Not; Max Operating Temperature: 125°C; Packaging: Tape and Reel; Package Quantity: 1; Taper: Linear; Max Power Dissipation: 500mW; Mount: Through Hole
R6-R8 R20 R21 = CMP-13261-001932-1: as R1 on sheet Alimentacion; Width: 0.063inch; Length: 0.126inch; Min Operating Temperature: -55°C; Packaging: Tape and Reel; Case Code (Metric): 3216; Contact Plating: Tin; Composition: Thick Film; Military Standard: Not; Depth: 1.6mm; Lead Free: Lead Free; Height: 0.026inch; Case Code (Imperial): 1206; Number of Terminations: 2; Radiation Hardening: No; Case/Package: 1206; Features: Moisture Resistant; Power Rating: 250mW; Max Operating Temperature: 155°C; Tolerance: 5%; Temperature Coefficient: 100ppm/°C
R9 R11-R19 = CMP-13261-001932-1: Res Thick Film 1206 10kΩ 5% 0.25W ±100ppm/°C Molded SMD T/R; Max Power Dissipation: 250mW; Resistance: 1kR; Voltage Rating (DC): 200V; Width: 0.063inch; Length: 0.126inch; Min Operating Temperature: -55°C; Packaging: Tape and Reel; Case Code (Metric): 3216; Contact Plating: Tin; Composition: Thick Film; Military Standard: Not; Depth: 1.6mm; Lead Free: Lead Free; Height: 0.026inch; Case Code (Imperial): 1206; Number of Terminations: 2; Radiation Hardening: No; Case/Package: 1206; Features: Moisture Resistant; Power Rating: 250mW; Max Operating Temperature: 155°C; Tolerance: 5%; Temperature Coefficient: 100ppm/°C
R10 = CMP-13261-001932-1: Res Thick Film 1206 1MΩ 5% 0.25W ±100ppm/°C Molded SMD T/R; Max Power Dissipation: 250mW; Resistance: 1kR; Voltage Rating (DC): 200V; Width: 0.063inch; Length: 0.126inch; Min Operating Temperature: -55°C; Packaging: Tape and Reel; Case Code (Metric): 3216; Contact Plating: Tin; Composition: Thick Film; Military Standard: Not; Depth: 1.6mm; Lead Free: Lead Free; Height: 0.026inch; Case Code (Imperial): 1206; Number of Terminations: 2; Radiation Hardening: No; Case/Package: 1206; Features: Moisture Resistant; Power Rating: 250mW; Max Operating Temperature: 155°C; Tolerance: 5%; Temperature Coefficient: 100ppm/°C
R22 R23 = CMP-13261-001932-1: Res Thick Film 1206 20kΩ 5% 0.25W ±100ppm/°C Molded SMD T/R; Max Power Dissipation: 250mW; Resistance: 1kR; Voltage Rating (DC): 200V; Width: 0.063inch; Length: 0.126inch; Min Operating Temperature: -55°C; Packaging: Tape and Reel; Case Code (Metric): 3216; Contact Plating: Tin; Composition: Thick Film; Military Standard: Not; Depth: 1.6mm; Lead Free: Lead Free; Height: 0.026inch; Case Code (Imperial): 1206; Number of Terminations: 2; Radiation Hardening: No; Case/Package: 1206; Features: Moisture Resistant; Power Rating: 250mW; Max Operating Temperature: 155°C; Tolerance: 5%; Temperature Coefficient: 100ppm/°C
U5-U7 = CMP-12131-000005-1: IC OPAMP GP 4 CIRCUIT 14SO; Manufacturer: STMicroelectronics; Voltage Gain: 100dB; Standoff Height: 0.1mm; Bandwidth: 1.3MHz; Max Junction Temp: +150°C; Min Supply Voltage: 3V; Max Dual Supply Voltage: 15V; Min Dual Supply Voltage: 1.5V; Number Of Channels: 4; Nominal Supply Current: 0.7-1.5mA; Output Current Per Channel: 20-50mA; Max Supply Voltage: 30V; Input Offset Voltage: 2mV; Input Bias Current: 0.02uA; Device Class L1: Integrated Circuits (ICs); Device Class L3: Amplifiers - Op Amps; Temperature Range Low: 0°C; Package: SO-14; Temperature Range High: +70°C; Digikey Description: IC OPAMP GP 4 CIRCUIT 14SO; Device Class L2: Linear ICs; Footprint Url: https://www.st.com/content/ccc/resource/technical/document/datasheet/group3/10/8a/e6/12/f8/e8/49/ce/DM00366438/files/DM00366438.pdf/jcr:content/translations/en.DM00366438.pdf; Octopart: https://octopart.com/lm324dt-stmicroelectronics-39579146; ComponentLink2URL: https://www.st.com/content/ccc/resource/technical/document/datasheet/bd/fc/46/43/26/8f/40/7f/CD00001046.pdf/files/CD00001046.pdf/jcr:content/translations/en.CD00001046.pdf; ComponentLink2Description: Datasheet; Lead Free: Yes; Temperature: 0°C to +70°C; RoHS: TRUE; Gain Bandwidth: 1.3MHz; Manufacturer Part Number: LM324DT; Automotive: No; Category: IC; Height: 1.75mm; Mouser Description: LM324 Series 32 V 1.3 MHz Low Power Quad Operational Amplifier - SOIC-14
U8 = CMP-09116-000394-1: IC INST AMP 1 CIRCUIT 8SOIC; Operating Supply Voltage: 18V; Max Power Dissipation: 650mW; Operating Supply Current: 1.3mA; Number of Channels: 1; Amplifier Type: INSTRUMENTATION AMPLIFIER; Input Offset Voltage (Vos): 30mV; Min Supply Voltage: 4.6V; Output Current per Channel: 18mA; Input Resistance: 10GR; Min Dual Supply Voltage: 2.3V; Common Mode Rejection Ratio: 93dB; Slew Rate: 1.2V/µs; -3db Bandwidth: 1MHz; Input Bias Current: 1nA; Number of Pins: 8; Case/Package: SOIC; Lead Free: Contains Lead; Max Operating Temperature: 125°C; Package Quantity: 1; Radiation Hardening: No; Contact Plating: Tin; Mount: Surface Mount; Min Operating Temperature: -55°C; Power Dissipation: 650mW; Nominal Supply Current: 1.3mA; Packaging: Tape and Reel; Number of Circuits: 1; RoHS Compliant: Yes; Number of Elements: 1; Max Dual Supply Voltage: 18V; Series: -

## Sheet Filtrado y amplificación.SchDoc
size A4; SheetNumber: 4
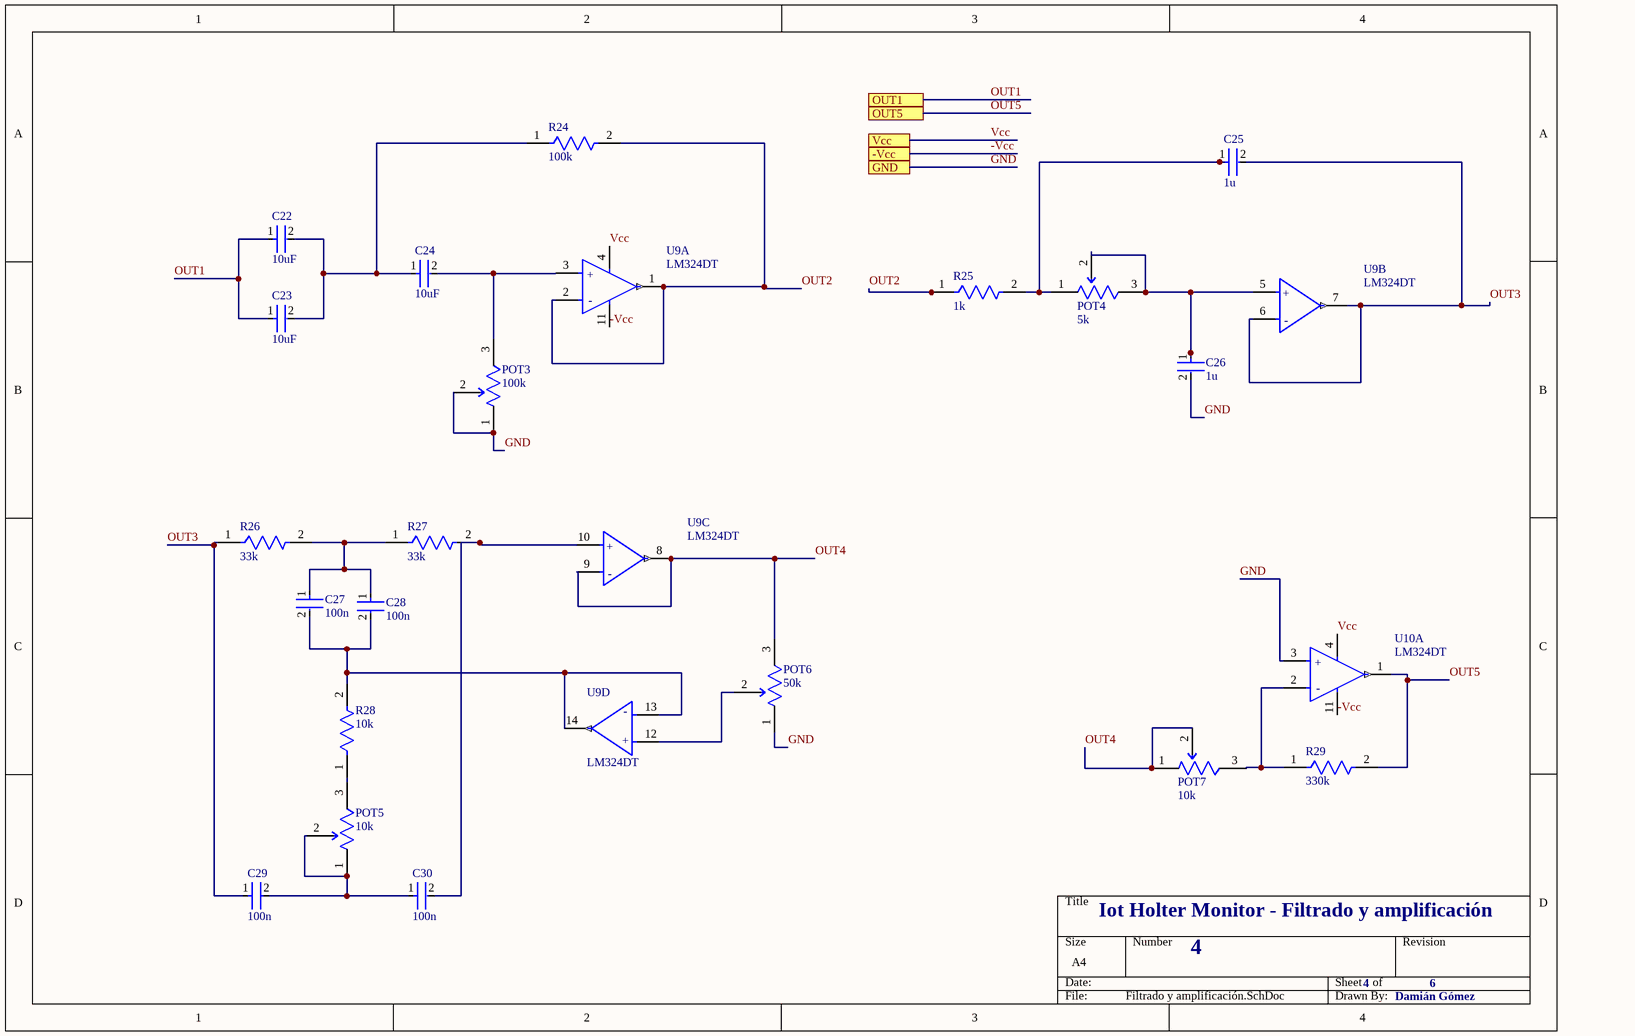
[diagram p3: Filtrado y amplificación.SchDoc]

### Parts
C22  10uF  [FP-CL31-IPC_C]
C23  10uF  [FP-CL31-IPC_C]
C24  10uF  [FP-CL31-IPC_C]
C25  1u  [FP-CL31-IPC_C]
C26  1u  [FP-CL31-IPC_C]
C27  100n  [FP-CL31-IPC_C]
C28  100n  [FP-CL31-IPC_C]
C29  100n  [FP-CL31-IPC_C]
C30  100n  [FP-CL31-IPC_C]
POT3  100k  [FP-3296W-MFG]
POT4  5k  [FP-3296W-MFG]
POT5  10k  [FP-3296W-MFG]
POT6  50k  [FP-3296W-MFG]
POT7  10k  [FP-3296W-MFG]
R24  100k  [FP-RC3216-MFG]
R25  1k  [FP-RC3216-MFG]
R26  33k  [FP-RC3216-MFG]
R27  33k  [FP-RC3216-MFG]
R28  10k  [FP-RC3216-MFG]
R29  330k  [FP-RC3216-MFG]
U9  LM324DT  [FP-SO-14-MFG]  (parts A,B,C,D of 4)
U10  LM324DT  [FP-SO-14-MFG]  (part A of 4)

### Ports
-Vcc, GND, OUT1, OUT5, Vcc

### Nets
GND: C26.2 POT3.1(CCW) POT3.2(WIPER) POT6.1(CCW) U10.3(Non-Inverting_Input_1) ; port GND
-Vcc: U9.11(VCC-) U10.11(VCC-) ; port -Vcc  [project net -5V]
OUT1: C22.1 C23.1 ; port OUT1
OUT2: R24.2 R25.1 U9.1(Output_1) U9.2(Inverting_Input_1)
OUT3: C25.2 C29.1 R26.1 U9.6(Inverting_Input_2) U9.7(Output_2)
OUT4: POT6.3(CW) POT7.1(CCW) POT7.2(WIPER) U9.8(Output_3) U9.9(Inverting_Input_3)
OUT5: R29.2 U10.1(Output_1) ; port OUT5
Vcc: U9.4(VCC+) U10.4(VCC+) ; port Vcc  [project net 5V]
NetC22_2: C22.2 C23.2 C24.1 R24.1
NetC24_2: C24.2 POT3.3(CW) U9.3(Non-Inverting_Input_1)
NetC25_1: C25.1 POT4.1(CCW) R25.2
NetC26_1: C26.1 POT4.2(WIPER) POT4.3(CW) U9.5(Non-Inverting_Input_2)
NetC27_1: C27.1 C28.1 R26.2 R27.1
NetC27_2: C27.2 C28.2 R28.2 U9.13(Inverting_Input_4) U9.14(Output_4)
NetC29_2: C29.2 C30.1 POT5.1(CCW) POT5.2(WIPER)
NetC30_2: C30.2 R27.2 U9.10(Non-Inverting_Input_3)
NetPOT5_3: POT5.3(CW) R28.1
NetPOT6_2: POT6.2(WIPER) U9.12(Non-Inverting_Input_4)
NetPOT7_3: POT7.3(CW) R29.1 U10.2(Inverting_Input_1)

### Notes on the sheet
- Iot Holter Monitor - Filtrado y amplificación
- 4
- 6
- Damián Gómez
- (in symbol CMP-12131-000005-1, part A) +; -
- (in symbol CMP-12131-000005-1, part B) +; -
- (in symbol CMP-12131-000005-1, part C) +; -
- (in symbol CMP-12131-000005-1, part D) -; +

### Library data of the parts
C22-C24 = CMP-13271-001211-1: as C13 on sheet Alimentacion; Tolerance: 5%; Voltage Rating (DC): 500V; Depth: 1.6mm; Max Operating Temperature: 125°C; Width: 0.063inch; Radiation Hardening: No; Thickness: 0.055inch; Packaging: Tape and Reel; Height: 1.25mm; Case/Package: 1206; Package Quantity: 10000; Dielectric: C0G; Mount: Surface Mount; Voltage Rating: 500V; Min Operating Temperature: -55°C; Length: 3.2mm
C25 C26 = CMP-13271-001211-1: Cap Ceramic 1uF 500V C0G ±5% SMD 1206 +125°C Embossed T/R; Capacitance: 220pF; Tolerance: 5%; Voltage Rating (DC): 500V; Depth: 1.6mm; Max Operating Temperature: 125°C; Width: 0.063inch; Radiation Hardening: No; Thickness: 0.055inch; Packaging: Tape and Reel; Height: 1.25mm; Case/Package: 1206; Package Quantity: 10000; Dielectric: C0G; Mount: Surface Mount; Voltage Rating: 500V; Min Operating Temperature: -55°C; Length: 3.2mm
C27-C30 = CMP-13271-001211-1: as C3 on sheet Alimentacion; Tolerance: 5%; Voltage Rating (DC): 500V; Depth: 1.6mm; Max Operating Temperature: 125°C; Width: 0.063inch; Radiation Hardening: No; Thickness: 0.055inch; Packaging: Tape and Reel; Height: 1.25mm; Case/Package: 1206; Package Quantity: 10000; Dielectric: C0G; Mount: Surface Mount; Voltage Rating: 500V; Min Operating Temperature: -55°C; Length: 3.2mm
POT3 = CMP-07234-000024-1: TRIMMER 100K OHM 0.5W PC PIN TOP; Resistance: 10kR; Temperature Coefficient: 100ppm/°C; Power Rating: 500mW; Tolerance: 10%; Number of Turns: 25; Width: 0.19inch; Termination: Pin; Radiation Hardening: No; Contact Plating: Tin; Composition: Cermet; Length: 9.53mm; Height: 0.395inch; Depth: 4.83mm; REACH SVHC: No SVHC; Weight: 0.03oz; Min Operating Temperature: -55°C; Military Standard: Not; Max Operating Temperature: 125°C; Packaging: Tape and Reel; Package Quantity: 1; Taper: Linear; Max Power Dissipation: 500mW; Mount: Through Hole
POT4 = CMP-07234-000024-1: TRIMMER 5K OHM 0.5W PC PIN TOP; Resistance: 10kR; Temperature Coefficient: 100ppm/°C; Power Rating: 500mW; Tolerance: 10%; Number of Turns: 25; Width: 0.19inch; Termination: Pin; Radiation Hardening: No; Contact Plating: Tin; Composition: Cermet; Length: 9.53mm; Height: 0.395inch; Depth: 4.83mm; REACH SVHC: No SVHC; Weight: 0.03oz; Min Operating Temperature: -55°C; Military Standard: Not; Max Operating Temperature: 125°C; Packaging: Tape and Reel; Package Quantity: 1; Taper: Linear; Max Power Dissipation: 500mW; Mount: Through Hole
POT5 POT7 = CMP-07234-000024-1: as POT2 on sheet Adquisicion de señal y preamplificacion; Width: 0.19inch; Termination: Pin; Radiation Hardening: No; Contact Plating: Tin; Composition: Cermet; Length: 9.53mm; Height: 0.395inch; Depth: 4.83mm; REACH SVHC: No SVHC; Weight: 0.03oz; Min Operating Temperature: -55°C; Military Standard: Not; Max Operating Temperature: 125°C; Packaging: Tape and Reel; Package Quantity: 1; Taper: Linear; Max Power Dissipation: 500mW; Mount: Through Hole
POT6 = CMP-07234-000024-1: TRIMMER 50K OHM 0.5W PC PIN TOP; Resistance: 10kR; Temperature Coefficient: 100ppm/°C; Power Rating: 500mW; Tolerance: 10%; Number of Turns: 25; Width: 0.19inch; Termination: Pin; Radiation Hardening: No; Contact Plating: Tin; Composition: Cermet; Length: 9.53mm; Height: 0.395inch; Depth: 4.83mm; REACH SVHC: No SVHC; Weight: 0.03oz; Min Operating Temperature: -55°C; Military Standard: Not; Max Operating Temperature: 125°C; Packaging: Tape and Reel; Package Quantity: 1; Taper: Linear; Max Power Dissipation: 500mW; Mount: Through Hole
R24 R25 = CMP-13261-001932-1: as R1 on sheet Alimentacion; Width: 0.063inch; Length: 0.126inch; Min Operating Temperature: -55°C; Packaging: Tape and Reel; Case Code (Metric): 3216; Contact Plating: Tin; Composition: Thick Film; Military Standard: Not; Depth: 1.6mm; Lead Free: Lead Free; Height: 0.026inch; Case Code (Imperial): 1206; Number of Terminations: 2; Radiation Hardening: No; Case/Package: 1206; Features: Moisture Resistant; Power Rating: 250mW; Max Operating Temperature: 155°C; Tolerance: 5%; Temperature Coefficient: 100ppm/°C
R26 R27 = CMP-13261-001932-1: Res Thick Film 1206 33kΩ 5% 0.25W ±100ppm/°C Molded SMD T/R; Max Power Dissipation: 250mW; Resistance: 1kR; Voltage Rating (DC): 200V; Width: 0.063inch; Length: 0.126inch; Min Operating Temperature: -55°C; Packaging: Tape and Reel; Case Code (Metric): 3216; Contact Plating: Tin; Composition: Thick Film; Military Standard: Not; Depth: 1.6mm; Lead Free: Lead Free; Height: 0.026inch; Case Code (Imperial): 1206; Number of Terminations: 2; Radiation Hardening: No; Case/Package: 1206; Features: Moisture Resistant; Power Rating: 250mW; Max Operating Temperature: 155°C; Tolerance: 5%; Temperature Coefficient: 100ppm/°C
R28 = CMP-13261-001932-1: as R9 on sheet Adquisicion de señal y preamplificacion; Width: 0.063inch; Length: 0.126inch; Min Operating Temperature: -55°C; Packaging: Tape and Reel; Case Code (Metric): 3216; Contact Plating: Tin; Composition: Thick Film; Military Standard: Not; Depth: 1.6mm; Lead Free: Lead Free; Height: 0.026inch; Case Code (Imperial): 1206; Number of Terminations: 2; Radiation Hardening: No; Case/Package: 1206; Features: Moisture Resistant; Power Rating: 250mW; Max Operating Temperature: 155°C; Tolerance: 5%; Temperature Coefficient: 100ppm/°C
R29 = CMP-13261-001932-1: Res Thick Film 1206 330kΩ 5% 0.25W ±100ppm/°C Molded SMD T/R; Max Power Dissipation: 250mW; Resistance: 1kR; Voltage Rating (DC): 200V; Width: 0.063inch; Length: 0.126inch; Min Operating Temperature: -55°C; Packaging: Tape and Reel; Case Code (Metric): 3216; Contact Plating: Tin; Composition: Thick Film; Military Standard: Not; Depth: 1.6mm; Lead Free: Lead Free; Height: 0.026inch; Case Code (Imperial): 1206; Number of Terminations: 2; Radiation Hardening: No; Case/Package: 1206; Features: Moisture Resistant; Power Rating: 250mW; Max Operating Temperature: 155°C; Tolerance: 5%; Temperature Coefficient: 100ppm/°C
U9 U10 = CMP-12131-000005-1: as U5 on sheet Adquisicion de señal y preamplificacion; Device Class L1: Integrated Circuits (ICs); Device Class L3: Amplifiers - Op Amps; Temperature Range Low: 0°C; Package: SO-14; Temperature Range High: +70°C; Digikey Description: IC OPAMP GP 4 CIRCUIT 14SO; Device Class L2: Linear ICs; Footprint Url: https://www.st.com/content/ccc/resource/technical/document/datasheet/group3/10/8a/e6/12/f8/e8/49/ce/DM00366438/files/DM00366438.pdf/jcr:content/translations/en.DM00366438.pdf; Octopart: https://octopart.com/lm324dt-stmicroelectronics-39579146; ComponentLink2URL: https://www.st.com/content/ccc/resource/technical/document/datasheet/bd/fc/46/43/26/8f/40/7f/CD00001046.pdf/files/CD00001046.pdf/jcr:content/translations/en.CD00001046.pdf; ComponentLink2Description: Datasheet; Lead Free: Yes; Temperature: 0°C to +70°C; RoHS: TRUE; Gain Bandwidth: 1.3MHz; Manufacturer Part Number: LM324DT; Automotive: No; Category: IC; Height: 1.75mm; Mouser Description: LM324 Series 32 V 1.3 MHz Low Power Quad Operational Amplifier - SOIC-14

## Sheet Acondicionamiento de la señal.SchDoc
size A4; SheetNumber: 5
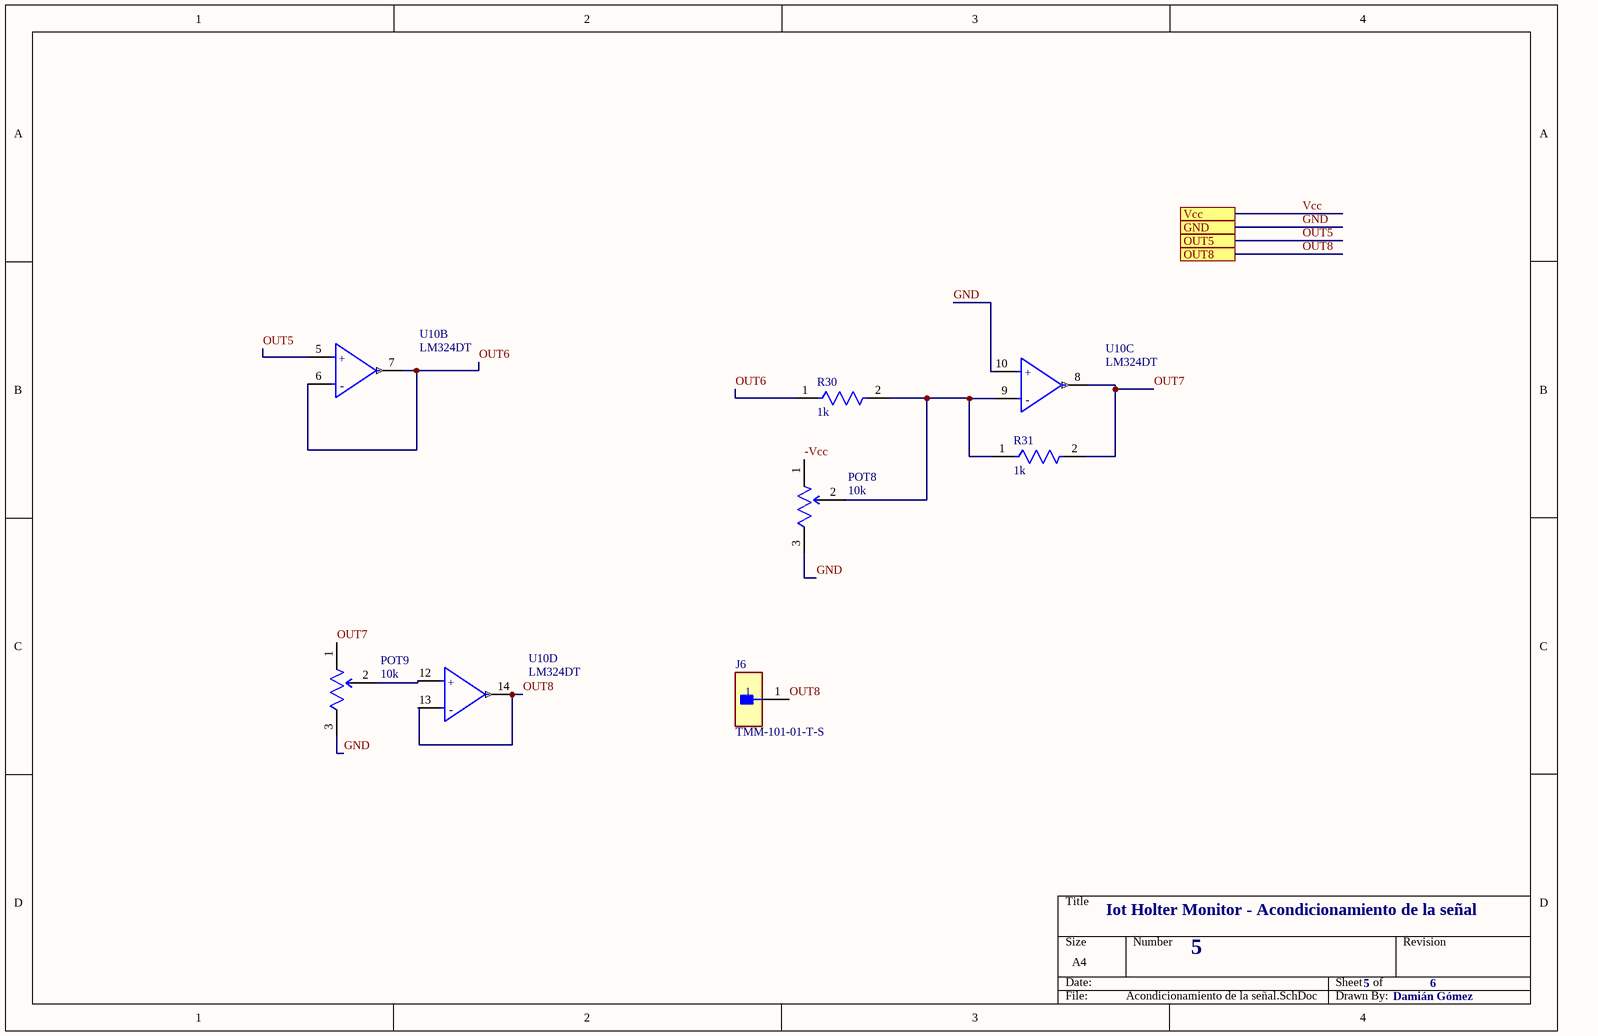
[diagram p4: Acondicionamiento de la señal.SchDoc]

### Parts
J6  TMM-101-01-T-S  [FP-TMM-101-01-T-S-MFG]
POT8  10k  [FP-3296W-MFG]
POT9  10k  [FP-3296W-MFG]
R30  1k  [FP-RC3216-MFG]
R31  1k  [FP-RC3216-MFG]
U10  LM324DT  [FP-SO-14-MFG]  (parts B,C,D of 4)

### Ports
GND, OUT5, OUT8, Vcc

### Nets
GND: POT8.3(CW) POT9.3(CW) U10.10(Non-Inverting_Input_3) ; port GND
-Vcc: POT8.1(CCW)
OUT5: U10.5(Non-Inverting_Input_2) ; port OUT5
OUT6: R30.1 U10.6(Inverting_Input_2) U10.7(Output_2)
OUT7: POT9.1(CCW) R31.2 U10.8(Output_3)
OUT8: J6.1 U10.13(Inverting_Input_4) U10.14(Output_4) ; port OUT8
NetPOT8_2: POT8.2(WIPER) R30.2 R31.1 U10.9(Inverting_Input_3)
NetPOT9_2: POT9.2(WIPER) U10.12(Non-Inverting_Input_4)

### Notes on the sheet
- Iot Holter Monitor - Acondicionamiento de la señal
- 5
- 6
- Damián Gómez
- (in symbol CMP-12131-000005-1, part B) +; -
- (in symbol CMP-12131-000005-1, part C) +; -
- (in symbol CMP-12131-000005-1, part D) +; -

### Library data of the parts
J6 = CMP-02766-001504-1: CONN HEADER VERT 1POS; Number of Positions: 1; Gender: Male; Lead Free: Lead Free; Contact Plating: Tin; Insulation Color: Black; Max Operating Temperature: 105°C; Connector Type: Header; Radiation Hardening: No; Packaging: Bulk; Contact Material: Bronze; Contact Shape: Square; Min Operating Temperature: -55°C; Contact Type: Male Pin; Insulation Material: Polymer; Series: TMM; Contact Finish - Mating: TIN; Fastening Type: Pull; Number of Rows: 1; Number of Contacts: 1; REACH SVHC: No SVHC; Mount: Through Hole; Termination: Solder
POT8 POT9 = CMP-07234-000024-1: as POT2 on sheet Adquisicion de señal y preamplificacion; Width: 0.19inch; Termination: Pin; Radiation Hardening: No; Contact Plating: Tin; Composition: Cermet; Length: 9.53mm; Height: 0.395inch; Depth: 4.83mm; REACH SVHC: No SVHC; Weight: 0.03oz; Min Operating Temperature: -55°C; Military Standard: Not; Max Operating Temperature: 125°C; Packaging: Tape and Reel; Package Quantity: 1; Taper: Linear; Max Power Dissipation: 500mW; Mount: Through Hole
R30 R31 = CMP-13261-001932-1: as R1 on sheet Alimentacion; Width: 0.063inch; Length: 0.126inch; Min Operating Temperature: -55°C; Packaging: Tape and Reel; Case Code (Metric): 3216; Contact Plating: Tin; Composition: Thick Film; Military Standard: Not; Depth: 1.6mm; Lead Free: Lead Free; Height: 0.026inch; Case Code (Imperial): 1206; Number of Terminations: 2; Radiation Hardening: No; Case/Package: 1206; Features: Moisture Resistant; Power Rating: 250mW; Max Operating Temperature: 155°C; Tolerance: 5%; Temperature Coefficient: 100ppm/°C
U10 = CMP-12131-000005-1: as U5 on sheet Adquisicion de señal y preamplificacion; Device Class L1: Integrated Circuits (ICs); Device Class L3: Amplifiers - Op Amps; Temperature Range Low: 0°C; Package: SO-14; Temperature Range High: +70°C; Digikey Description: IC OPAMP GP 4 CIRCUIT 14SO; Device Class L2: Linear ICs; Footprint Url: https://www.st.com/content/ccc/resource/technical/document/datasheet/group3/10/8a/e6/12/f8/e8/49/ce/DM00366438/files/DM00366438.pdf/jcr:content/translations/en.DM00366438.pdf; Octopart: https://octopart.com/lm324dt-stmicroelectronics-39579146; ComponentLink2URL: https://www.st.com/content/ccc/resource/technical/document/datasheet/bd/fc/46/43/26/8f/40/7f/CD00001046.pdf/files/CD00001046.pdf/jcr:content/translations/en.CD00001046.pdf; ComponentLink2Description: Datasheet; Lead Free: Yes; Temperature: 0°C to +70°C; RoHS: TRUE; Gain Bandwidth: 1.3MHz; Manufacturer Part Number: LM324DT; Automotive: No; Category: IC; Height: 1.75mm; Mouser Description: LM324 Series 32 V 1.3 MHz Low Power Quad Operational Amplifier - SOIC-14